# Altium schematic sheet Archimedes_Surucu_Kati.SchDoc: Step Motor Sürücü Katı Tasarımı
size A4; DrawnBy: Emre Rasim; DocumentNumber: 6; Revision: 1.0; SheetNumber: 3; SheetTotal: 7; Sematikicerigi: Step Motor Sürücü Katı Tasarımı
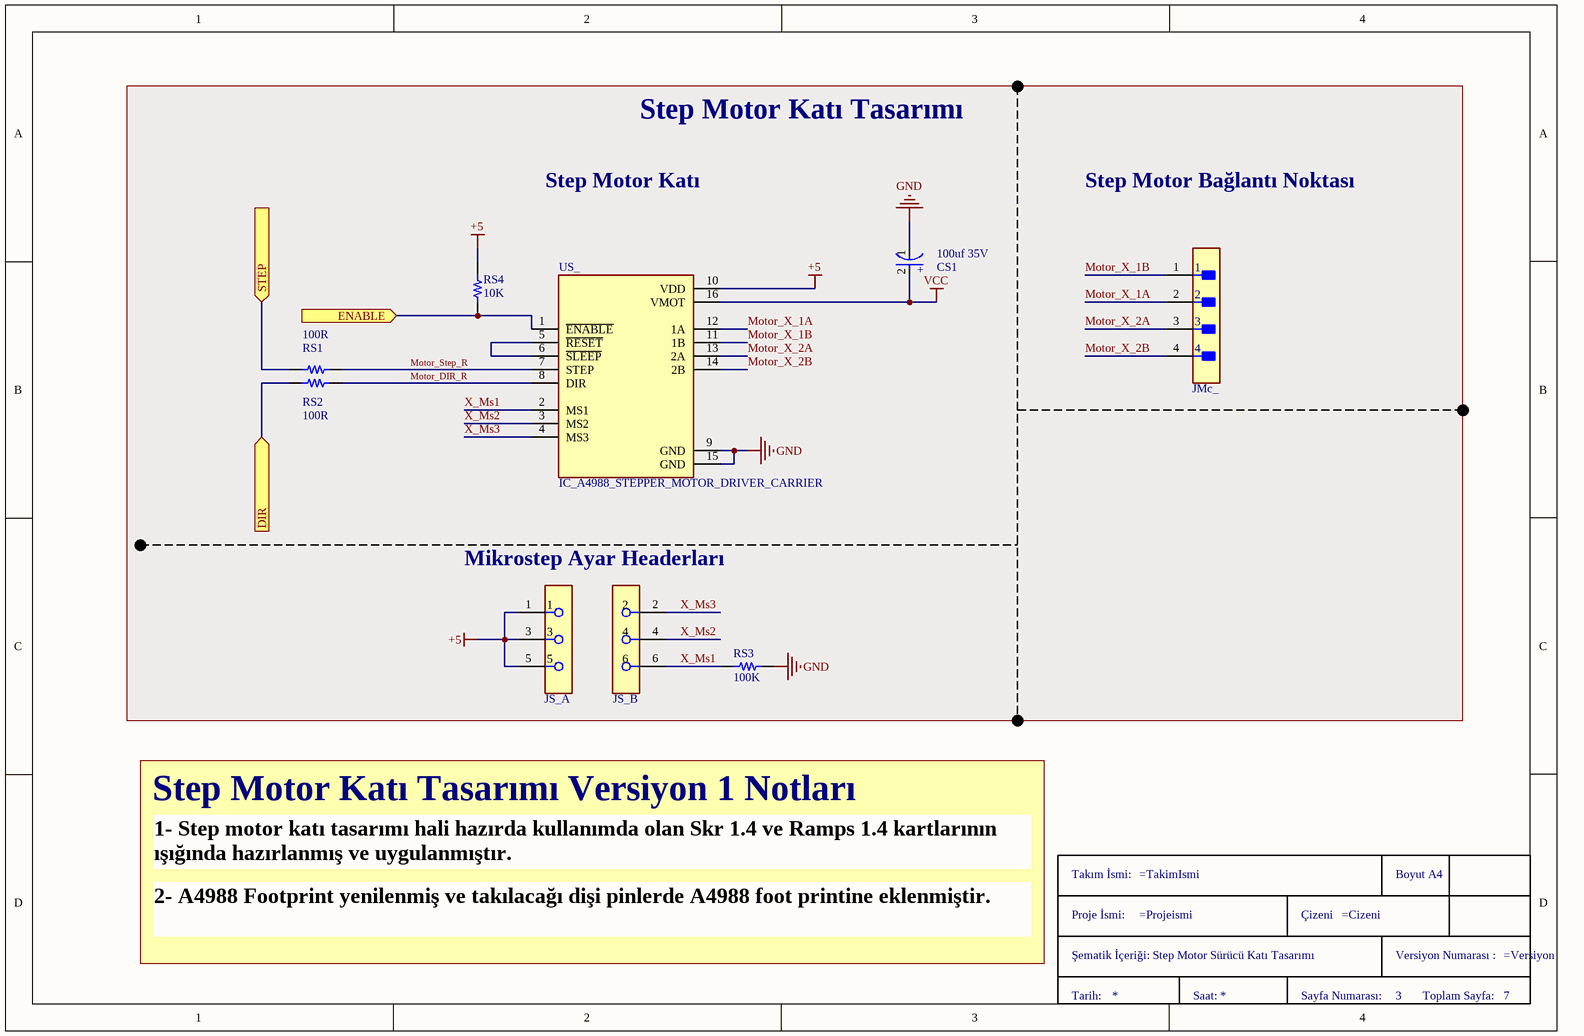
[diagram p0: Archimedes_Surucu_Kati.SchDoc]

## Parts
CS1  100uf 35V  [C_Smd_D6.3_H_7.7_Electrolytic_Cap]
JMc_  2.5 mm locked  [CON_2.5MM_4_LEAD_180_LOCKED]  (value not drawn)
JS_  Con_3*2_Male_Header  [Con_3*2_Male_header]  (value not drawn)  (parts A,B of 2)
RS1  100R  [RES 0805/2012]
RS2  100R  [RES 0805/2012]
RS3  100K  [RES 0805/2012]
RS4  10K  [RES 0805/2012]
TitleBlock-A4  TitleBlock-A4  (value not drawn)  (graphical)
US_  IC_A4988_STEPPER_MOTOR_DRIVER_CARRIER  [IC_A4988_STEPPER_MOTOR_DRIVER_CARRIER]

## Blocks framed on the sheet
Step Motor Katı Tasarımı: CS1 JMc_ JS_ RS1-RS4 US_

## Ports
DIR (in), ENABLE (in), STEP (in)

## Nets
+5: JS_.1 JS_.3 JS_.5 RS4.2 US_.10(VDD)
GND: CS1.1(C) RS3.2 US_.9(GND) US_.15(GND)
VCC: CS1.2(A) US_.16(VMOT)
DIR: RS2.1 ; port DIR
ENABLE: RS4.1 US_.1(~{ENABLE}) ; port ENABLE
Motor_DIR_R: RS2.2 US_.8(DIR)
Motor_Step_R: RS1.2 US_.7(STEP)
Motor_X_1A: JMc_.2 US_.12(1A)
Motor_X_1B: JMc_.1 US_.11(1B)
Motor_X_2A: JMc_.3 US_.13(2A)
Motor_X_2B: JMc_.4 US_.14(2B)
STEP: RS1.1 ; port STEP
X_Ms1: JS_.6 RS3.1 US_.2(MS1)
X_Ms2: JS_.4 US_.3(MS2)
X_Ms3: JS_.2 US_.4(MS3)
NetUS__5: US_.5(~{RESET}) US_.6(~{SLEEP})

## Notes on the sheet
- Step Motor Katı
- Step Motor Bağlantı Noktası
- (near JS_) Mikrostep Ayar Headerları
- Step Motor Katı Tasarımı Versiyon 1 Notları
- 1- Step motor katı tasarımı hali hazırda kullanımda olan Skr 1.4 ve Ramps 1.4 kartlarının ışığında hazırlanmış ve uygulanmıştır.
- 2- A4988 Footprint yenilenmiş ve takılacağı dişi pinlerde A4988 foot printine eklenmiştir.
- (in symbol C_smd_D6.3_H7.7) +
- (in symbol TitleBlock-A4) Takım İsmi:; Boyut A4; Proje İsmi:; Çizeni; Şematik İçeriği:; Versiyon Numarası :; Tarih:; Saat:; Sayfa Numarası:; Toplam Sayfa:

## Library data of the parts
CS1 = C_smd_D6.3_H7.7: electrolytic capacitor with 100 uf and 35 volt rating
JMc_ = Con_2.5mm_4_lead_180_locked: 2.5 mm 4 lead locked connector
JS_ = Con_3*2_Male_Header: 3*2 male header
RS1 RS2 = Resistor 805: 100 R ohm Resistor  with 805 pack and %1 tolerance rating
RS3 = Resistor 805: 100 K ohm Resistor  with 805 pack and %1 tolerance rating
RS4 = Resistor 805: 10 K ohm Resistor  with 805 pack and %1 tolerance rating
TitleBlock-A4 = TitleBlock-A4: Title Block for İTU eklemeli imalat takımı
US_ = IC_A4988_STEPPER_MOTOR_DRIVER_CARRIER: Stepper motor controler; IC: A4988; 1A; Uin mot: 8Ã·35V; Package: None; Availability: Unavailable; Value: *; MP: A4988_STEPPER_MOTOR_DRIVER_CARRIER; Price: None